# EAGLE design final routing_ratsnest (EAGLE 7.6.0)
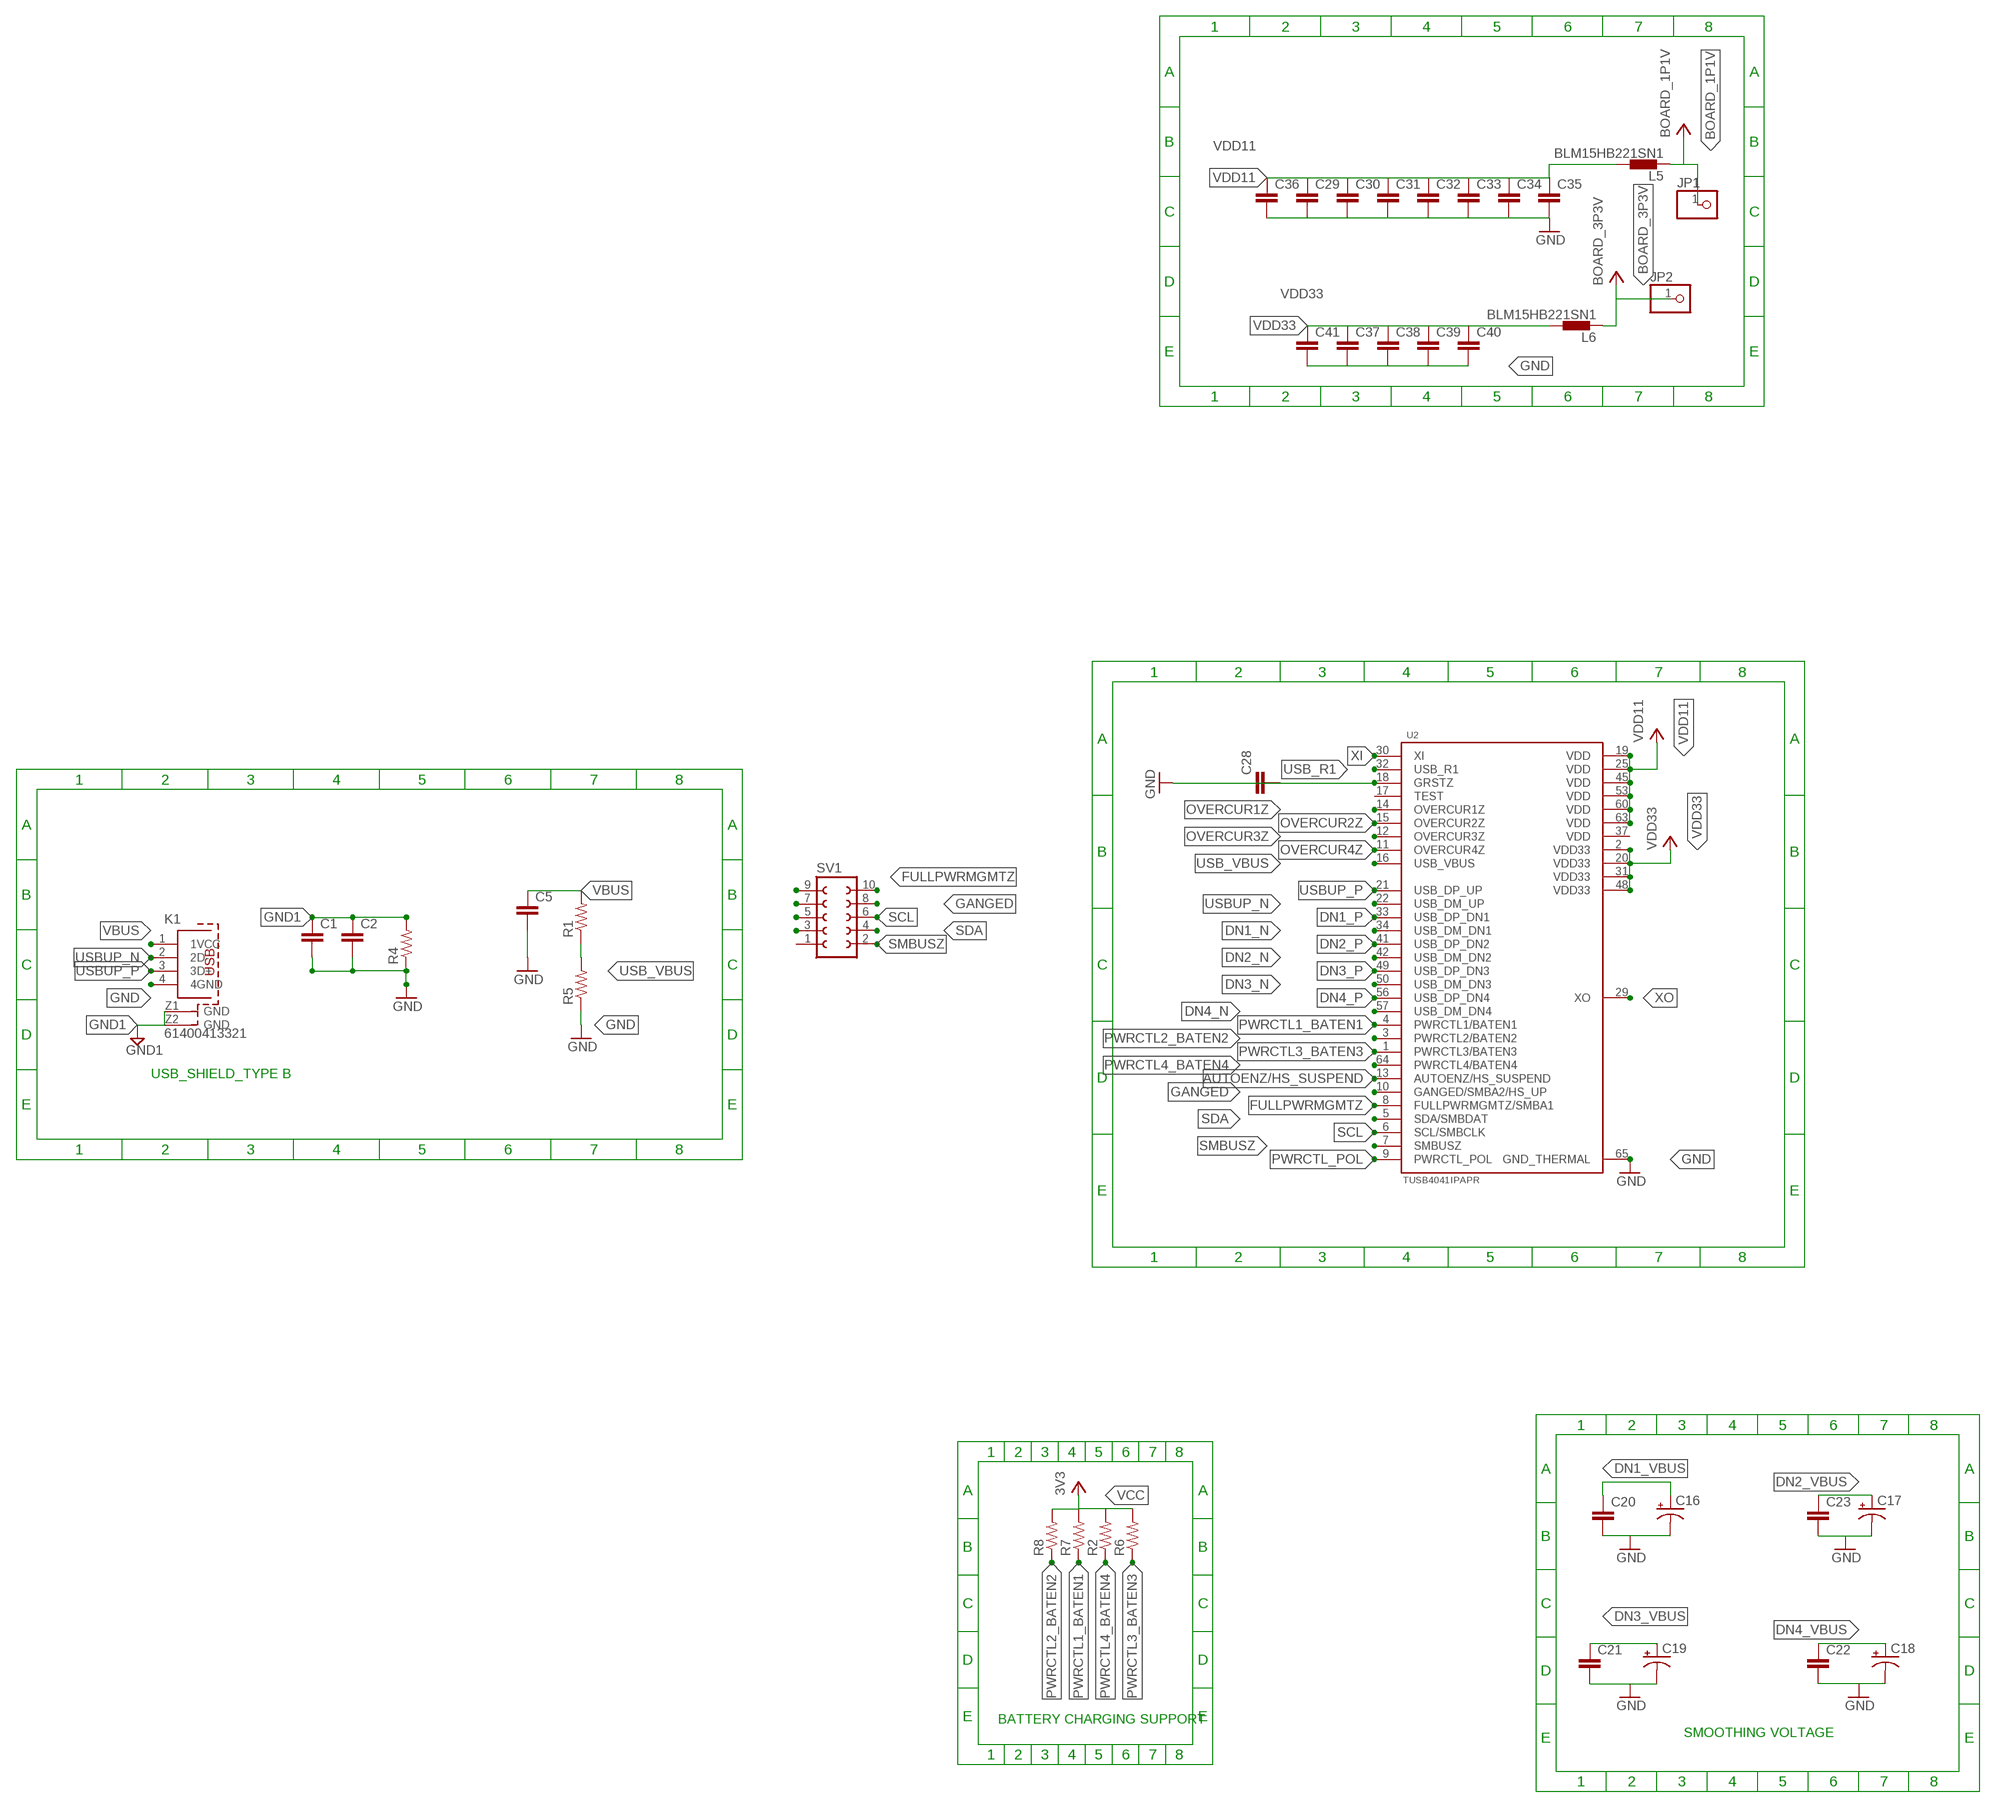
[diagram p0: schematic, sheet 1, part 1 of 2]
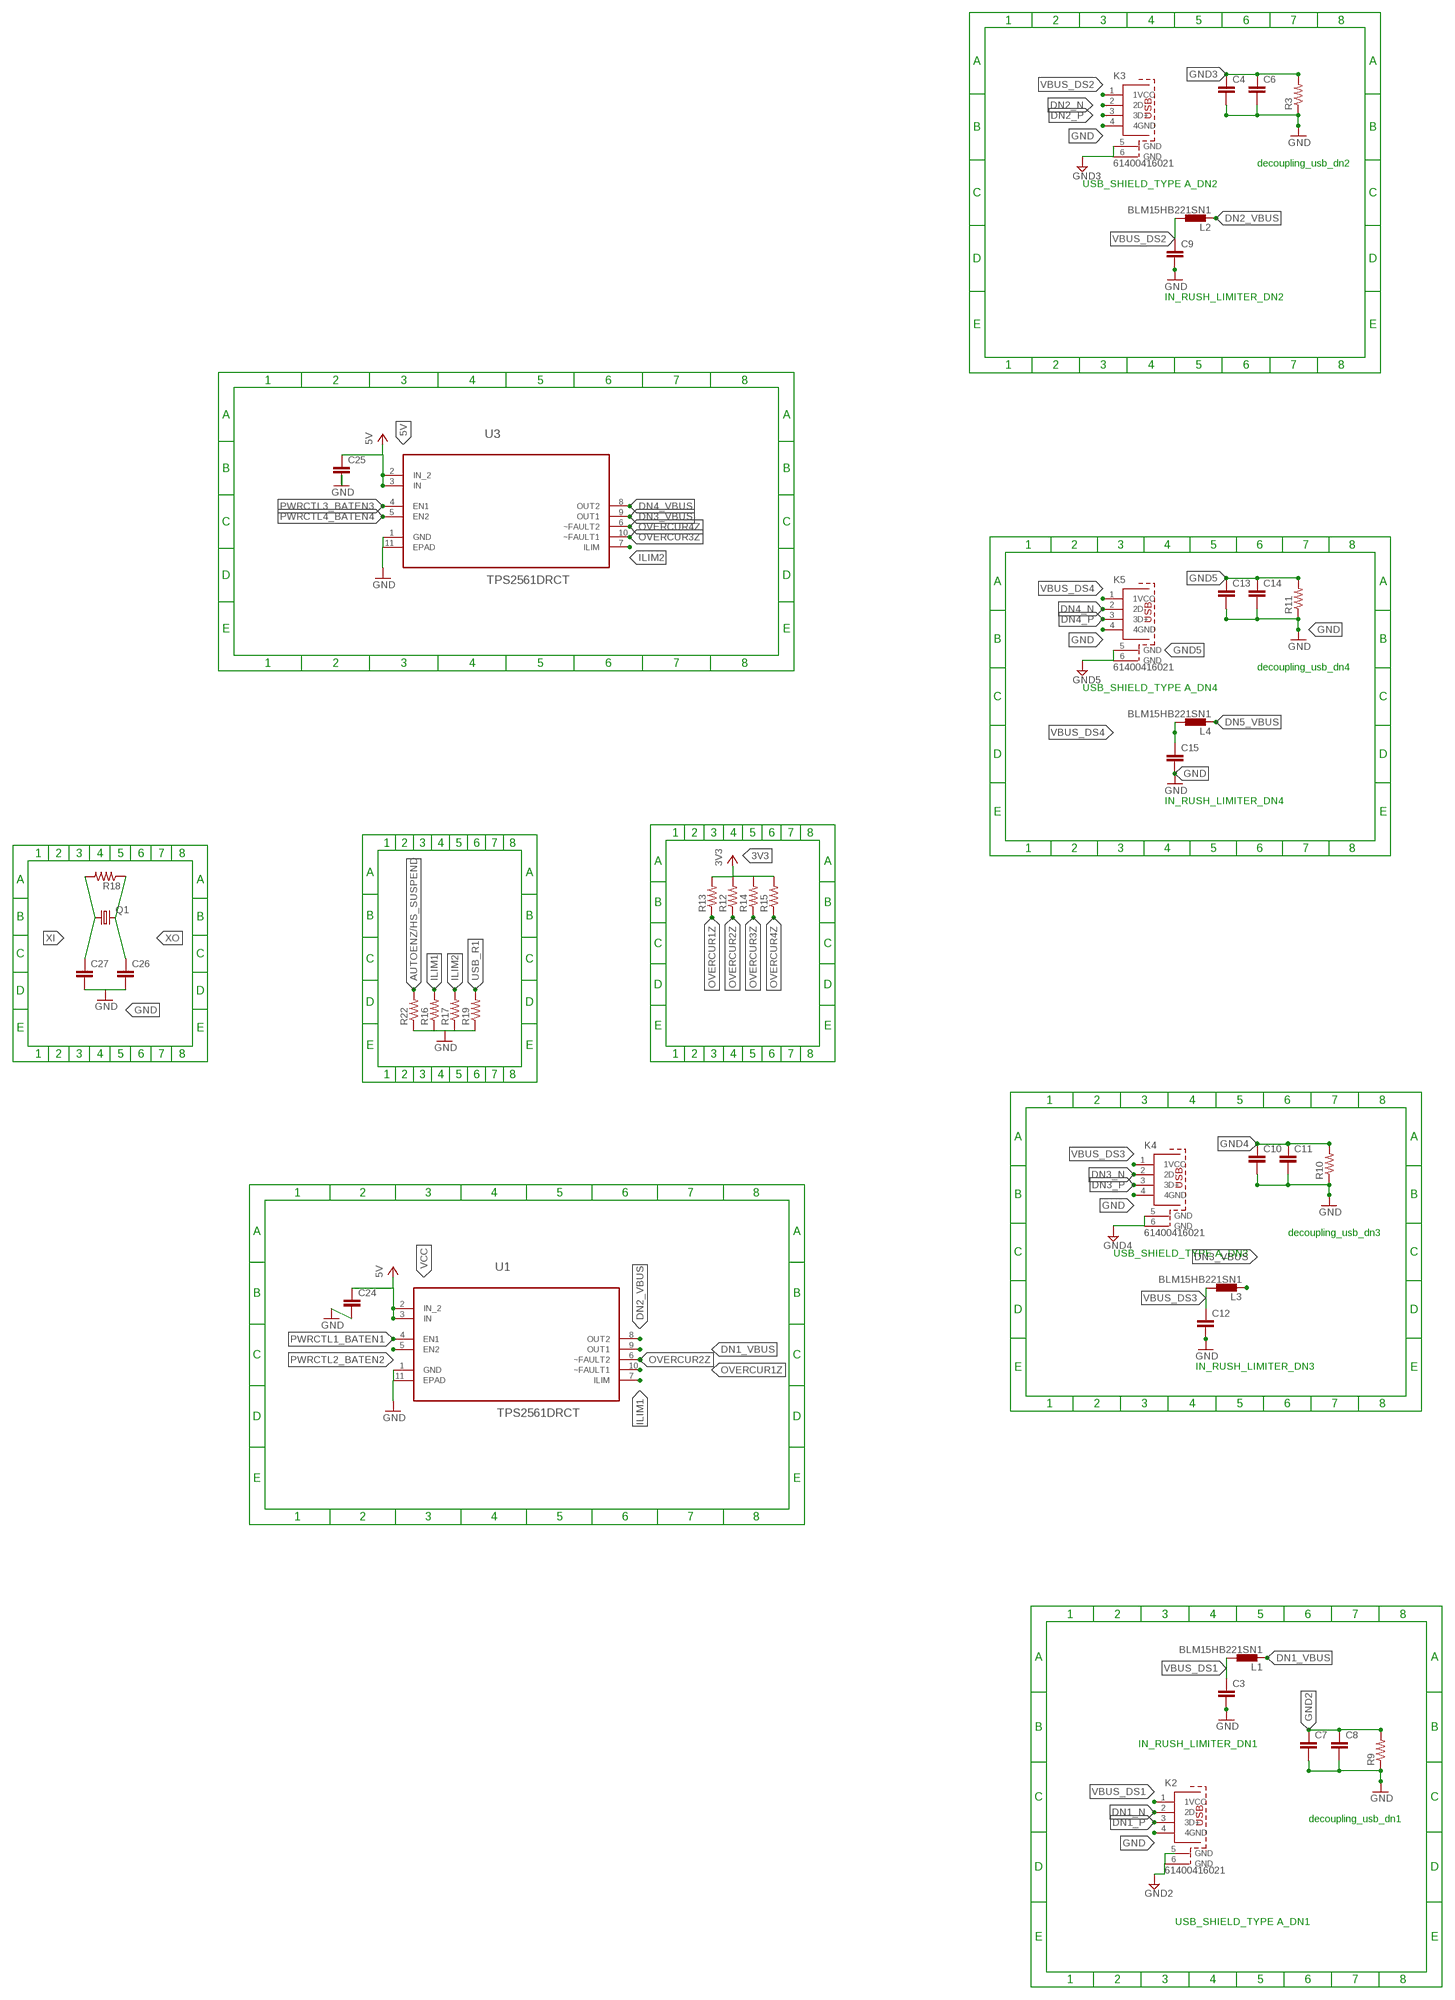
[diagram p1: schematic, sheet 1, part 2 of 2]

## Parts
C1  C2.5/4  [C2.5-4]
C2  C2.5/4  [C2.5-4]
C3  C2.5/4  [C2.5-4]
C4  C2.5/4  [C2.5-4]
C5  C2.5/4  [C2.5-4]
C6  C2.5/4  [C2.5-4]
C7  C2.5/4  [C2.5-4]
C8  C2.5/4  [C2.5-4]
C9  C2.5/4  [C2.5-4]
C10  C2.5/4  [C2.5-4]
C11  C2.5/4  [C2.5-4]
C12  C2.5/4  [C2.5-4]
C13  C2.5/4  [C2.5-4]
C14  C2.5/4  [C2.5-4]
C15  C2.5/4  [C2.5-4]
C16  CPOL-USE5-5  [E5-5]
C17  CPOL-USE5-5  [E5-5]
C18  CPOL-USE5-5  [E5-5]
C19  CPOL-USE5-5  [E5-5]
C20  C2.5/2  [C2.5-2]
C21  C2.5/2  [C2.5-2]
C22  C2.5/2  [C2.5-2]
C23  C2.5/2  [C2.5-2]
C24  C2.5/2  [C2.5-2]
C25  C2.5/2  [C2.5-2]
C26  C2.5/2  [C2.5-2]
C27  C2.5/2  [C2.5-2]
C28  C2.5/2  [C2.5-2]
C29  C2.5/2  [C2.5-2]
C30  C2.5/2  [C2.5-2]
C31  C2.5/2  [C2.5-2]
C32  C2.5/2  [C2.5-2]
C33  C2.5/2  [C2.5-2]
C34  C2.5/2  [C2.5-2]
C35  C2.5/2  [C2.5-2]
C36  C2.5/2  [C2.5-2]
C37  C2.5/2  [C2.5-2]
C38  C2.5/2  [C2.5-2]
C39  C2.5/2  [C2.5-2]
C40  C2.5/2  [C2.5-2]
C41  C2.5/2  [C2.5-2]
JP1  PINHD-1X1  [1X01]
JP2  PINHD-1X1  [1X01]
K1  61400413321  [61400413321]
K2  61400416021  [61400416021]
K3  61400416021  [61400416021]
K4  61400416021  [61400416021]
K5  61400416021  [61400416021]
L1  BLM15HB221SN1  [0402]
L2  BLM15HB221SN1  [0402]
L3  BLM15HB221SN1  [0402]
L4  BLM15HB221SN1  [0402]
L5  BLM15HB221SN1  [0402]
L6  BLM15HB221SN1  [0402]
Q1  CRYSTALHC49S  [HC49/S]
R1  R-US_R2010W  [R2010W]
R2  R-US_R2010W  [R2010W]
R3  R-US_R2010W  [R2010W]
R4  R-US_R2010W  [R2010W]
R5  R-US_R2010W  [R2010W]
R6  R-US_R2010W  [R2010W]
R7  R-US_R2010W  [R2010W]
R8  R-US_R2010W  [R2010W]
R9  R-US_R2010W  [R2010W]
R10  R-US_R2010W  [R2010W]
R11  R-US_R2010W  [R2010W]
R12  R-US_R2010W  [R2010W]
R13  R-US_R2010W  [R2010W]
R14  R-US_R2010W  [R2010W]
R15  R-US_R2010W  [R2010W]
R16  R-US_R2010W  [R2010W]
R17  R-US_R2010W  [R2010W]
R18  R-US_R2010W  [R2010W]
R19  R-US_R2010W  [R2010W]
R22  R-US_R2010W  [R2010W]
SV1  FE05-2  [FE05-2]
U1  TPS2561DRCT  [SON50P300X300X100-11N]
U2  TUSB4041IPAPR  [QFP50P1200X1200X105-65N]
U3  TPS2561DRCT  [SON50P300X300X100-11N]

## Nets
3V3: R12.2 R13.2 R14.2 R15.2
5V: C25.1 U3.2(IN_2) U3.3(IN)
AUTOENZ/HS_SUSPEND: R22.2 U2.13(AUTOENZ/HS_SUSPEND)
BOARD_1P1V: JP1.1 L5.1
BOARD_3P3V: JP2.1 L6.1
DN1_N: K2.2(2D-) U2.34(USB_DM_DN1)
DN1_P: K2.3(3D+) U2.33(USB_DP_DN1)
DN1_VBUS: C16.+ C20.1 L1.1 U1.9(OUT1)
DN2_N: K3.2(2D-) U2.42(USB_DM_DN2)
DN2_P: K3.3(3D+) U2.41(USB_DP_DN2)
DN2_VBUS: C17.+ C23.1 L2.1 U1.8(OUT2)
DN3_N: K4.2(2D-) U2.50(USB_DM_DN3)
DN3_P: K4.3(3D+) U2.49(USB_DP_DN3)
DN3_VBUS: C19.+ C21.1 L3.1 U3.9(OUT1)
DN4_N: K5.2(2D-) U2.57(USB_DM_DN4)
DN4_P: K5.3(3D+) U2.56(USB_DP_DN4)
DN4_VBUS: C18.+ C22.1 U3.8(OUT2)
DN5_VBUS: L4.1
FULLPWRMGMTZ: SV1.10 U2.8(FULLPWRMGMTZ/SMBA1)
GANGED: SV1.8 U2.10(GANGED/SMBA2/HS_UP)
GND: C1.2 C2.2 C3.2 C4.2 C5.2 C6.2 C7.2 C8.2 C9.2 C10.2 C11.2 C12.2 C13.2 C14.2 C15.2 C16.- C17.- C18.- C19.- C20.2 C21.2 C22.2 C23.2 C24.2 C25.2 C26.2 C27.2 C28.2 C29.2 C30.2 C31.2 C32.2 C33.2 C34.2 C35.2 C36.2 C37.2 C38.2 C39.2 C40.2 C41.2 K1.4(4GND) K2.4(4GND) K3.4(4GND) K4.4(4GND) K5.4(4GND) R3.1 R4.1 R5.1 R9.1 R10.1 R11.1 R16.1 R17.1 R19.1 R22.1 U1.1(GND) U1.11(EPAD) U2.65(GND_THERMAL) U3.1(GND) U3.11(EPAD)
GND1: C1.1 C2.1 K1.Z1(GND) K1.Z2(GND) R4.2
GND2: C7.1 C8.1 K2.5(GND) K2.6(GND) R9.2
GND3: C4.1 C6.1 K3.5(GND) K3.6(GND) R3.2
GND4: C10.1 C11.1 K4.5(GND) K4.6(GND) R10.2
GND5: C13.1 C14.1 K5.5(GND) K5.6(GND) R11.2
GRSTZ: C28.1 U2.18(GRSTZ)
ILIM1: R16.2 U1.7(ILIM)
ILIM2: R17.2 U3.7(ILIM)
N$2: SV1.3
N$3: SV1.5
N$4: SV1.7
N$5: SV1.9
OVERCUR1Z: R13.1 U1.10(~FAULT1) U2.14(OVERCUR1Z)
OVERCUR2Z: R12.1 U1.6(~FAULT2) U2.15(OVERCUR2Z)
OVERCUR3Z: R14.1 U2.12(OVERCUR3Z) U3.10(~FAULT1)
OVERCUR4Z: R15.1 U2.11(OVERCUR4Z) U3.6(~FAULT2)
PWRCTL1_BATEN1: R7.1 U1.4(EN1) U2.4(PWRCTL1/BATEN1)
PWRCTL2_BATEN2: R8.1 U1.5(EN2) U2.3(PWRCTL2/BATEN2)
PWRCTL3_BATEN3: R6.1 U2.1(PWRCTL3/BATEN3) U3.4(EN1)
PWRCTL4_BATEN4: R2.1 U2.64(PWRCTL4/BATEN4) U3.5(EN2)
PWRCTL_POL: U2.9(PWRCTL_POL)
SCL: SV1.6 U2.6(SCL/SMBCLK)
SDA: SV1.4 U2.5(SDA/SMBDAT)
SMBUSZ: SV1.2 U2.7(SMBUSZ)
USB_R1: R19.2 U2.32(USB_R1)
USB_VBUS: R1.1 R5.2 U2.16(USB_VBUS)
USBUP_N: K1.2(2D-) U2.22(USB_DM_UP)
USBUP_P: K1.3(3D+) U2.21(USB_DP_UP)
VBUS: C5.1 K1.1(1VCC) R1.2
VBUS_DS1: C3.1 K2.1(1VCC) L1.2
VBUS_DS2: C9.1 K3.1(1VCC) L2.2
VBUS_DS3: C12.1 K4.1(1VCC) L3.2
VBUS_DS4: C15.1 K5.1(1VCC) L4.2
VCC: C24.1 R2.2 R6.2 R7.2 R8.2 U1.2(IN_2) U1.3(IN) ; supply symbol labelled 3V3, 5V
VDD11: C29.1 C30.1 C31.1 C32.1 C33.1 C34.1 C35.1 C36.1 L5.2 U2.19(VDD) U2.25(VDD) U2.45(VDD) U2.53(VDD) U2.60(VDD) U2.63(VDD)
VDD33: C37.1 C38.1 C39.1 C40.1 C41.1 L6.2 U2.2(VDD33) U2.20(VDD33) U2.31(VDD33) U2.48(VDD33)
XI: C27.1 Q1.1 R18.2 U2.30(XI)
XO: C26.1 Q1.2 R18.1 U2.29(XO)
Unconnected: SV1.1 U2.17(TEST)

## Notes on the sheet
- decoupling_usb_dn2
- USB_SHIELD_TYPE A_DN2
- IN_RUSH_LIMITER_DN2
- decoupling_usb_dn4
- USB_SHIELD_TYPE A_DN4
- IN_RUSH_LIMITER_DN4
- USB_SHIELD_TYPE B
- decoupling_usb_dn3
- USB_SHIELD_TYPE A_DN3
- IN_RUSH_LIMITER_DN3
- BATTERY CHARGING SUPPORT
- SMOOTHING VOLTAGE
- IN_RUSH_LIMITER_DN1
- decoupling_usb_dn1
- USB_SHIELD_TYPE A_DN1

## Power pins joined to a net without a drawn wire
VDD: U2.37(VDD)

## Library data of the parts
C1-C15 C20-C41 = capacitor-wima:C: CAPACITOR naming: grid - package width
C16-C19 = rcl:CPOL-US: POLARIZED CAPACITOR, American symbol
JP1 JP2 = pinhead:PINHD-1X1: PIN HEADER
K1 = Wurth_Input-Output_Connectors_rev15d:61400413321: WR-COM Vertical USB Type B,4 pins=>Code : Con_I-O_COM_USB-2.0_B_61400413321 <http://katalog.we-online.de/media/images/eican/Con_I-O_COM_USB-2.0_B_61400413321_pf2.jpg> Details see: http://katalog.we-online.de/en/em/614_0xx_133_21 Created 2014-07-09, Karrer Zheng 2014 (C) Würth Elektronik
K2-K5 = Wurth_Input-Output_Connectors_rev15d:61400416021: WR-COM Horizontal USB Type A=>Code :Con_I-O_COM_USB_2.0_A_61400416021 <http://katalog.we-online.de/media/images/eican/Con_I-O_COM_USB_2.0_A_61400416021_pf2.jpg> Details see: http://katalog.we-online.de/en/em/614_004_160_21 Created 2014-07-09, Karrer Zheng 2014 (C) Würth Elektronik
L1-L6 = inductors:BLM15H: EMIFIL (R) Chip Ferrite Bead for GHz Noise Source: http://www.murata.com/ Ferrite Bead BLM15H.pdf
Q1 = crystal:CRYSTAL: CRYSTAL; OC_FARNELL: 1667008; OC_NEWARK: unknown
R1-R19 R22 = resistor:R-US_: RESISTOR, American symbol
SV1 = con-lsta:FE05-2: FEMALE HEADER; OC_FARNELL: unknown; OC_NEWARK: unknown
U1 U3 = TPS2561DRCT:TPS2561DRCT: DUAL CHANNEL PRECISION ADJUSTABLE CURRENT-LIMITED POWER SWITCHES; AVAILABILITY: Good; DESCRIPTION: Dual Channel Precision Adjustable Current-Limited Power Switches 10-VSON -40 to 85; MF: Texas Instruments; MP: TPS2561DRCT; PACKAGE: VSON-10 Texas Instruments; PRICE: 1.89 USD
U2 = TUSB4041IPAPR:TUSB4041IPAPR: Four-Port USB 2.0 Hub 64-HTQFP -40 to 85; AVAILABILITY: Warning; DESCRIPTION: Four-Port USB 2.0 Hub 64-HTQFP -40 to 85; MF: Texas Instruments; MP: TUSB4041IPAPR; PACKAGE: HTQFP-64 Texas Instruments; PRICE: 4.30 USD

## Net classes
0 DN4: width 0.254 mm, drill 0.381 mm, clearance 0.254 mm
1 DN3: width 0.254 mm, drill 0.381 mm, clearance 0.254 mm
2 DN2: width 0.254 mm, drill 0.381 mm, clearance 0.254 mm
3 DN1: width 0.254 mm, drill 0.381 mm, clearance 0.254 mm

## Board
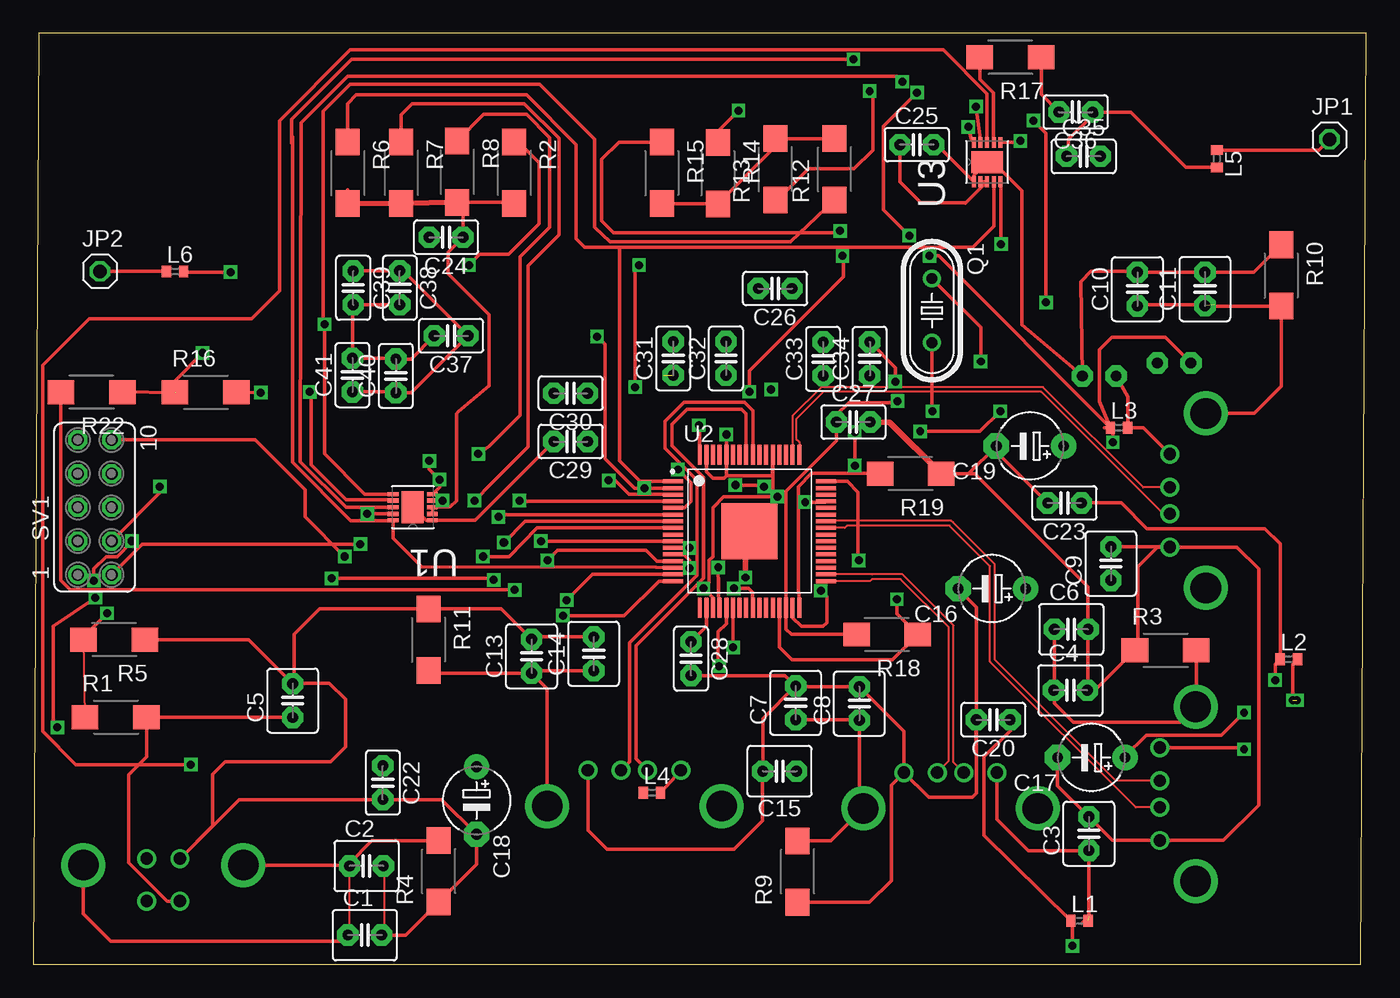
[diagram p2: board, top side]
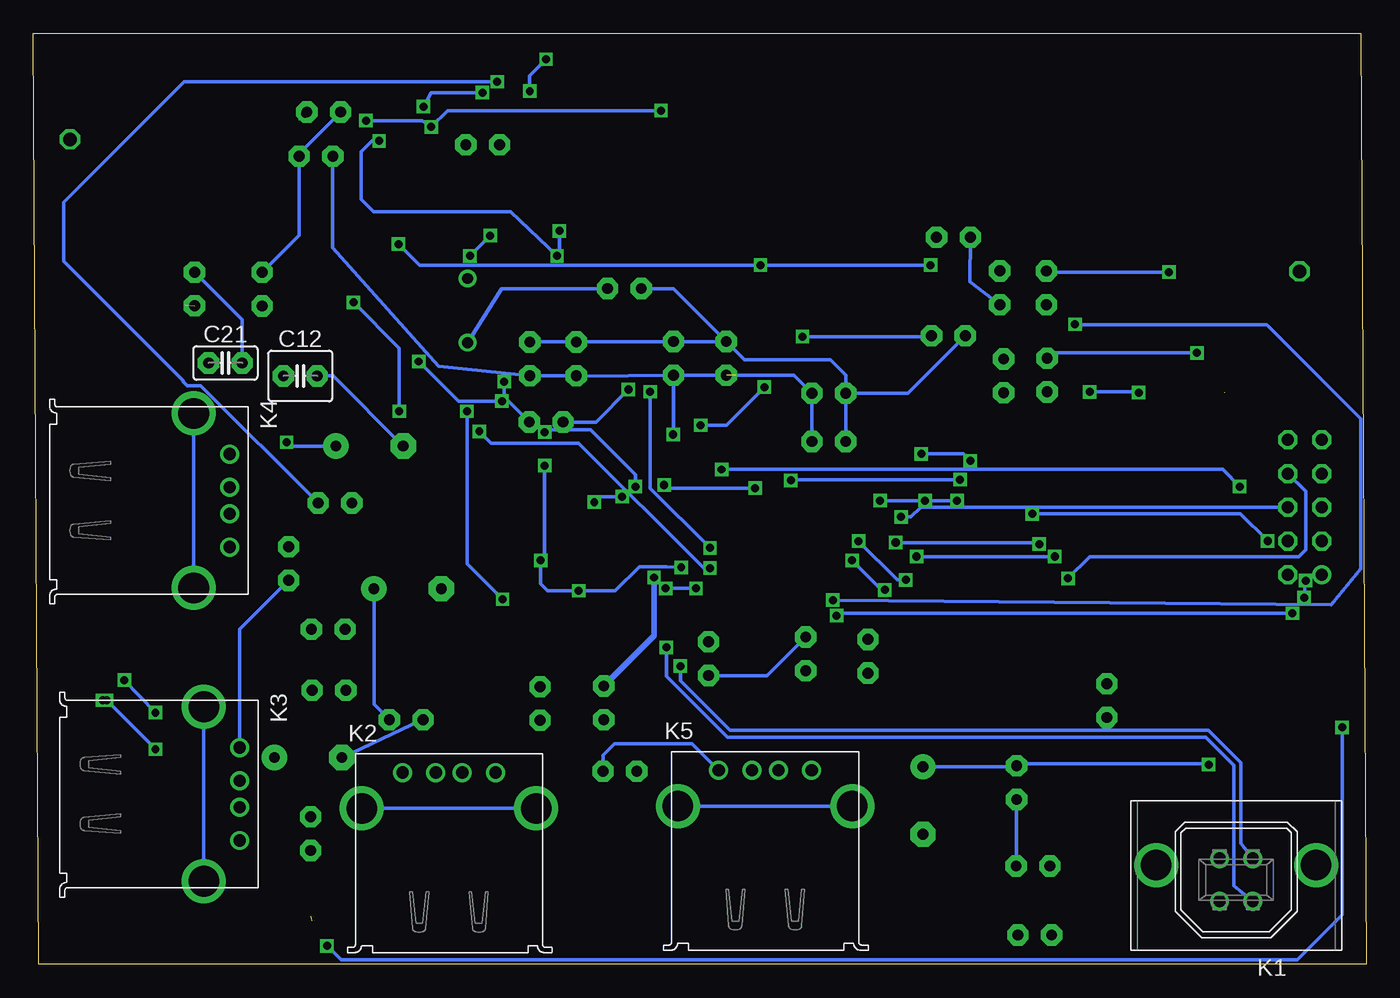
[diagram p3: board, bottom side, seen from below]

Size 100.41 x 70.11 mm. Coordinates in mm from the lower left corner, seen from the top.
Outline: 0,0 100,0 100.41,70.11 0.41,70.11 0,0
Copper layers (1*16): Top 0.035mm / dielectric 1.5mm / Bottom 0.035mm
Design rules "default *": minimum track width 6mil, minimum drill 24mil, track to track 8mil, track to pad 8mil, pad to pad 8mil, via to via 8mil, smd to smd 8mil, copper to edge 40mil, drill to drill 8mil, minimum pad ring 10mil, minimum via ring 8mil, stop-mask expansion 4mil, vias tented up to drill 0mil, thermal gap 10mil

### Footprints (pad centres in the part's own frame; a part is rotated, then mirrored left to right if it is on the bottom)
C2.5-4 = drill 0.813 pad 1.6 octagon: 1 -1.27,0; 2 1.27,0
E5-5 = drill 0.813 pad 1.905: + -2.54,0 | drill 0.813 pad 1.905 octagon: - 2.54,0
C2.5-2 = drill 0.813 pad 1.6 octagon: 1 -1.27,0; 2 1.27,0
1X01 = drill 1.016 octagon: 1 0,0
61400413321 = drill 0.92: 1 1.25,0; 2 -1.25,0; 3 -1.25,-3.2; 4 1.25,-3.2 | drill 2.3: Z1 -6.02,-2.7; Z2 6.02,-2.7
61400416021 = drill 0.92: 1 -3.5,2.7; 2 -1,2.7; 3 1,2.7; 4 3.5,2.7 | drill 2.3: 5 -6.57,0; 6 6.57,0
0402 = smd 0.7 x 0.9: 1 -0.65,0; 2 0.65,0
HC49/S = drill 0.813: 1 -2.413,0; 2 2.413,0
R2010W = smd 2 x 1.8: 1 -2.311,0; 2 2.311,0
FE05-2 = drill 0.914: 1 -5.08,1.27 | drill 0.914 octagon: 2 -5.08,-1.27; 3 -2.54,1.27; 4 -2.54,-1.27; 5 0,1.27; 6 0,-1.27; 7 2.54,1.27; 8 2.54,-1.27; 9 5.08,1.27; 10 5.08,-1.27
SON50P300X300X100-11N = smd 0.813 x 0.305: 1 -1.473,0.991; 2 -1.473,0.508; 3 -1.473,0; 4 -1.473,-0.508; 5 -1.473,-0.991; 6 1.473,-0.991; 7 1.473,-0.508; 8 1.473,0; 9 1.473,0.508; 10 1.473,0.991 | smd 1.651 x 2.388: 11 0,0
QFP50P1200X1200X105-65N = smd 1.5 x 0.3: 1 -5.75,3.75; 2 -5.75,3.25; 3 -5.75,2.75; 4 -5.75,2.25; 5 -5.75,1.75; 6 -5.75,1.25; 7 -5.75,0.75; 8 -5.75,0.25; 9 -5.75,-0.25; 10 -5.75,-0.75; 11 -5.75,-1.25; 12 -5.75,-1.75; 13 -5.75,-2.25; 14 -5.75,-2.75; 15 -5.75,-3.25; 16 -5.75,-3.75; 33 5.75,-3.75; 34 5.75,-3.25; 35 5.75,-2.75; 36 5.75,-2.25; 37 5.75,-1.75; 38 5.75,-1.25; 39 5.75,-0.75; 40 5.75,-0.25; 41 5.75,0.25; 42 5.75,0.75; 43 5.75,1.25; 44 5.75,1.75; 45 5.75,2.25; 46 5.75,2.75; 47 5.75,3.25; 48 5.75,3.75 | smd 0.3 x 1.5: 17 -3.75,-5.75; 18 -3.25,-5.75; 19 -2.75,-5.75; 20 -2.25,-5.75; 21 -1.75,-5.75; 22 -1.25,-5.75; 23 -0.75,-5.75; 24 -0.25,-5.75; 25 0.25,-5.75; 26 0.75,-5.75; 27 1.25,-5.75; 28 1.75,-5.75; 29 2.25,-5.75; 30 2.75,-5.75; 31 3.25,-5.75; 32 3.75,-5.75; 49 3.75,5.75; 50 3.25,5.75; 51 2.75,5.75; 52 2.25,5.75; 53 1.75,5.75; 54 1.25,5.75; 55 0.75,5.75; 56 0.25,5.75; 57 -0.25,5.75; 58 -0.75,5.75; 59 -1.25,5.75; 60 -1.75,5.75; 61 -2.25,5.75; 62 -2.75,5.75; 63 -3.25,5.75; 64 -3.75,5.75 | smd 4.2 x 4.2: 65 0,0

### Placement (x,y rotation side)
C1  24.98,2.21 0 top
C2  25.1,7.42 0 top
C3  79.51,9.84 90 top
C4  78.12,20.64 0 top
C5  19.55,19.87 90 top
C6  78.18,25.23 0 top
C7  57.43,19.69 90 top
C8  62.22,19.64 90 top
C9  81.18,30.18 90 top
C10  83.17,50.84 90 top
C11  88.26,50.85 90 top
C12  80.29,44.3 0 bottom
C13  37.54,23.2 90 top
C14  42.22,23.39 90 top
C15  56.22,14.55 180 top
C16  72.21,28.29 180 top
C17  79.7,15.57 180 top
C18  33.39,12.34 270 top
C19  75.08,39.03 180 top
C20  72.32,18.42 180 top
C21  85.93,45.29 0 bottom
C22  26.33,13.68 270 top
C23  77.67,34.74 180 top
C24  31.1,54.75 180 top
C25  66.55,61.72 0 top
C26  55.88,50.89 180 top
C27  61.77,40.84 0 top
C28  49.55,23.02 270 top
C29  40.48,39.37 180 top
C30  40.48,43 180 top
C31  48.21,45.63 90 top
C32  52.18,45.63 90 top
C33  59.5,45.59 90 top
C34  63.01,45.6 90 top
C35  79.11,60.84 0 top
C36  78.52,64.18 180 top
C37  31.48,47.33 180 top
C38  27.61,50.95 270 top
C39  24.1,50.94 270 top
C40  27.32,44.31 90 top
C41  24.05,44.38 90 top
JP1  97.64,62.13 0 top
JP2  5.03,52.18 0 top
K1  9.8,4.77 180 bottom
K2  69.09,11.74 0 bottom
K3  87.56,12.83 270 bottom
K4  88.32,34.92 270 bottom
K5  45.28,11.92 0 bottom
L1  78.81,3.27 0 top
L2  94.57,22.99 0 top
L3  81.79,40.42 0 top
L4  46.6,12.93 0 top
L5  89.14,60.66 270 top
L6  10.68,52.17 0 top
Q1  67.69,49.23 270 top
R1  6.22,18.62 0 top
R2  36.23,59.6 270 top
R3  85.29,23.65 0 top
R4  30.54,7.01 90 top
R5  6.11,24.46 180 top
R6  23.69,59.6 270 top
R7  27.72,59.61 270 top
R8  31.93,59.68 270 top
R9  57.57,6.99 90 top
R10  94,51.88 270 top
R11  29.77,24.45 270 top
R12  60.37,59.86 90 top
R13  55.89,59.86 90 top
R14  51.56,59.58 270 top
R15  47.35,59.6 270 top
R16  12.99,43.08 0 top
R17  73.61,68.3 180 top
R18  64.32,24.84 180 top
R19  66.09,36.95 180 top
R22  4.4,43.09 180 top
SV1  4.63,34.42 90 top
U1  28.59,34.42 180 top
U2  53.95,32.62 0 top
U3  71.85,60.41 90 top

### Tracks (layer width: path | path; a pad name or v marks a point on that pad's centre or on a via)
3V3
  Top 0.254: R12.2 R13.2 55.89,61.6 R14.2 47.37,57.27 R15.2
5V
  Top 0.254: 70.21,57.3 70.24,57.33 | 70.24,57.33 U3.3 U3.2 | C25.1 65.28,58.92 66.86,57.33 70.24,57.33
AUTOENZ/HS_SUSPEND  (via drill 0.61)
  Top 0.254: U2.13 46.97,30.37 46.16,31.18 39.49,31.18 v38.73,30.42 | v36.27,28.2 5.38,28.2 4.5,28.2 2.81,28.2 2.09,28.91 R22.2
  Bottom 0.254: v38.73,30.42 36.5,28.2 v36.27,28.2
BOARD_1P1V
  Top 0.254: L5.1 96.82,61.31 JP1.1
BOARD_3P3V
  Top 0.254: JP2.1 10.02,52.18 L6.1
DN1_N
  Top 0.152: K2.2 69.33,15.21 69.33,25.52 65.48,29.37 63.18,29.37 U2.34
DN1_P
  Top 0.152: K2.3 68.97,15.32 68.97,25.37 65.33,29.01 63.18,29.01 63.03,28.87 U2.33
DN1_VBUS  (via drill 0.61)
  Top 0.254: C20.1 73.59,17.61 71.6,15.62 71.6,9.71 L1.1 78.27,3.16 v78.27,1.4 | U1.9 27.1,33.93 v25.16,33.93 | v7.43,31.88 7.43,31.82 6.32,30.71 5.5,30.71 4.56,29.78 v4.56,28.9 | v4.68,27.61 4.62,27.55 1.52,25.45 1.52,18.14 v1.81,17.84
  Bottom 0.254: C20.1 74.75,19.58 C16.+ | v25.16,33.93 9.48,33.93 v7.43,31.88 | v4.56,28.9 4.62,28.43 v4.68,27.61 | v1.81,17.84 1.81,3.74 5.21,0.35 77.22,0.35 v78.27,1.4
DN2_N
  Top 0.152: K3.2 81.54,13.83 72.42,22.95 72.42,30.14 69.27,33.3 69.25,33.3 69.15,33.4 59.74,33.4
  Top 0.254: 59.74,33.4 U2.42
DN2_P
  Top 0.152: K3.3 83.04,11.83 72.07,22.8 72.07,30 69.02,33.04 61.71,33.04 61.3,33.04 61.13,32.88 59.72,32.88
  Top 0.254: 59.72,32.88 U2.41
DN2_VBUS  (via drill 0.6)
  Top 0.254: C23.1 81.97,34.74 83.89,32.82 92.78,32.82 93.92,31.68 L2.1 93.54,22.61 v93.54,21.41 | C17.+ 82.24,15.66 83.83,17.26 89.5,17.26 v91.2,18.95 | U1.8 23.55,34.42 20.12,37.85 20.18,62.59 20.18,63.35 23.69,66.86 65.05,66.86 v65.46,66.46
  Bottom 0.254: v91.2,18.95 v93.54,21.41 | C23.1 87.78,43.58 88.8,43.58 89.1,43.88 89.1,43.93 98.11,52.94 98.11,57.39 89.04,66.46 66.28,66.46 v65.46,66.46
DN3_N
  Top 0.152: K4.2 83.61,35.92 76.06,43.47 59.36,43.47 57.2,41.31 U2.50 | U2.50
DN3_P
  Top 0.152: K4.3 85.11,33.92 75.92,43.11 59.51,43.11 57.46,41.06 57.46,39.6 57.7,39.35 U2.49
DN3_VBUS  (via drill 0.6, 0.61)
  Top 0.254: L3.1 80.67,40.42 | v66.57,65.64 64.06,63.12 64.06,56.8 v65.99,54.87 | v71.02,64.58 71.37,61.91 U3.9 | v67.51,53.35 68.21,53.35 L3.1 | v81.31,39.31 81.31,40.24 L3.1 | C21.1 85.28,47.21 81.26,47.21 80.32,46.27 80.32,42.41 L3.1
  Bottom 0.254: v66.57,65.64 70.43,65.64 v71.02,64.58 | v65.99,54.87 v67.51,53.35 | C19.+ 81.03,39.03 v81.31,39.31
DN4_N
  Top 0.254: K5.2 45.42,15.48 45.42,24 50.51,29.09 50.51,36.67 48.11,39.07 48.11,40.67 49.24,41.81 53.36,41.81 53.7,41.47 U2.57
DN4_P
  Top 0.254: K5.3 44.91,15.25 44.91,24.21 50,29.3 50,36.46 47.6,38.86 47.6,40.88 49.03,42.32 53.57,42.32 54.2,41.69 U2.56
DN4_VBUS  (via drill 0.61)
  Top 0.254: v11.88,15.03 3.22,15.03 0.7,17.55 0.7,45.1 4.21,48.61 16.44,48.61 18.54,50.72 18.54,63.53 23.87,68.86 68.56,68.86 71.85,65.57 U3.8
  Bottom 0.254: C22.1 26.41,14.88 C18.+ 26.25,14.88 26.03,15.09 11.93,15.09 v11.88,15.03
FULLPWRMGMTZ  (via drill 0.61)
  Top 0.254: U2.8 37.96,32.87 35.86,30.71 v33.87,30.71 | v23.46,30.71 20.48,33.7 20.48,35.74 16.72,39.49 SV1.10
  Bottom 0.254: v33.87,30.71 v23.46,30.71
GANGED  (via drill 0.61)
  Top 0.254: U2.10 v38.24,31.87 | v22.46,29.07 34.57,29.07 v34.69,28.96
  Bottom 0.254: v22.46,29.07 20.83,30.71 5.09,30.71 4.56,31.24 4.56,35.62 SV1.8 | v34.69,28.96 35.33,28.96 v38.24,31.87
GND  (via drill 0.6, 0.61)  (1 unrouted)
  Top 0.152: C2.2 26.44,7.35 26.44,1.58
  Top 0.254: C1.2 28.06,2.21 R4.1 33.39,7.54 C18.- 30.77,12.41 C22.2 15.5,12.41 K1.4 13.51,10.43 13.51,14.33 14.45,15.27 22.41,15.27 23.52,16.38 23.52,19.95 22.29,21.18 19.59,21.18 C5.2 | 65.52,14.38 K2.4 | R3.1 79.96,20.64 C4.2 79.45,20.7 C6.2 79.44,25.25 79.44,28.43 70.93,36.95 R19.1 70.45,36.95 C19.- 72.54,38.61 C23.2 | C7.2 57.48,20.91 C8.2 65.59,17.55 K2.4 | 86.35,31.42 90.67,31.42 92.31,29.78 92.31,11.99 89.65,9.33 K3.4 81.3,9.33 C3.2 77.16,13.47 C17.- | 86.35,31.42 K4.4 84.66,31.42 83.19,29.95 83.19,23.17 | 88.25,52.11 C10.2 83.1,52.18 79.68,52.18 78.9,51.41 C12.2 74.47,48.15 74.47,58.27 72.33,60.41 U3.11 70.86,59.42 U3.1 68.07,61.72 C25.2 | 88.25,52.11 C11.2 | 88.25,52.11 91.93,52.11 R10.1 | C7.2 54.95,18.49 C15.2 54.93,14.53 54.93,10.82 52.77,8.66 43.23,8.66 41.78,10.11 K5.4 | C14.2 37.72,24.66 C13.2 35.24,26.77 R11.1 21.56,26.77 19.66,24.86 19.66,21.24 C5.2 | C38.2 27.6,49.67 C39.2 24.05,49.62 C41.2 27.25,45.65 C40.2 28.46,45.58 C37.2 | C16.- 71.05,26.91 C20.2 71.05,18.34 | K2.4 67.46,12.58 70.73,12.58 71.05,12.9 | R9.1 63,4.68 64.64,6.32 64.64,13.5 K2.4 | C9.2 86.31,31.45 86.35,31.42 | C29.2 33.27,33.43 U1.1 29.58,33.43 U1.11 | R22.1 6.74,43.11 10.71,43.06 | R17.1 75.92,65.51 C36.2 | R5.1 16.23,24.46 C5.2 | R16.1 10.68,43.96 v12.75,46.04 | 71.05,12.9 71.02,18.66 | v64.94,43.88 64.94,44.94 C34.2 | C28.2 56.64,21.75 C7.2 | 71.05,12.9 71.05,18.34 | 71.05,18.34 v71.14,18.43
  Top 0.406: C27.2 64.51,40.84 R19.1 | U2.65 53.65,32.31 v53.65,29.13
  Bottom 0.254: C33.2 | C33.2 C34.2 | C29.2 C30.2 | C33.2 52.21,46.87 C32.2 C31.2 | C31.2 46.82,45.51 40.37,45.51 39.21,44.36 C30.2 | C31.2 52.2,50.89 C26.2 | C36.2 80.56,60.87 C35.2 80.38,54.9 C10.2 | C28.2 45.12,21.75 C14.2 | C22.2 26.37,12.37 C2.2 | C21.2 84.66,48.53 C11.2 | v12.75,46.04 23.66,46.04 C41.2 | C37.2 34.54,43 C30.2 | C38.2 29.84,51.38 C24.2 | C19.- 77.81,44.3 C12.2 | C27.2 64.94,42.73 v64.94,43.88 | v71.14,18.43 C17.-
  Bottom 0.406: v53.65,29.13 53.65,24.75 C7.2
GND1
  Top 0.152: C1.1 23.83,2.34 C2.1
  Top 0.254: K1.Z1 3.78,3.82 5.85,1.75 23.25,1.75 C1.1 | K1.Z2 23.78,7.47 C2.1 23.83,7.63 25.51,9.3 30.53,9.3 R4.2
GND2
  Top 0.254: R9.2 60.08,9.3 K2.6 62.22,12.04 C8.1 62.17,18.42 C7.1
  Bottom 0.254: K2.6 K2.5
GND3
  Top 0.254: C6.1 76.92,20.7 | 76.92,20.7 C4.1 | R3.2 87.6,19.44 K3.5 86.41,18.25 78.33,18.25 76.92,19.67 76.92,20.7
  Bottom 0.254: K3.5 K3.6
GND4  (1 unrouted)
  Top 0.254: C10.1 83.26,49.67 88.98,49.67 89.08,49.56 R10.2 94.01,43.52 91.98,41.49 K4.5
  Bottom 0.254: K4.5 K4.6
GND5
  Top 0.254: R11.2 29.98,21.93 C13.1 | C13.1 37.72,22.12 C14.1 | C13.1 38.71,20.76 K5.6
  Bottom 0.254: K5.6 K5.5
GRSTZ
  Top 0.254: U2.18 50.7,25.45 C28.1
ILIM1  (via drill 0.61)
  Top 0.254: U1.7 27.07,34.98 23.58,34.98 20.94,37.62 20.94,43 v20.83,43.11 | v17.14,43.06 R16.2
  Bottom 0.254: v20.83,43.11 17.2,43.11 v17.14,43.06
ILIM2
  Top 0.254: R17.2 71.3,66.65 72.31,65.64 72.31,61.94 U3.7
OVERCUR1Z  (via drill 0.6)
  Top 0.254: 19.54,62.3 19.54,61.78 | 19.54,61.78 19.54,37.79 23.93,33.4 27.09,33.4 U1.10 27.12,32.08 29.25,29.95 46.92,29.89 U2.14 | R13.1 56.03,57.55 58.38,59.9 61.83,59.9 63.24,61.31 63.24,65.52 v63.01,65.75 | v61.78,68.15 23.98,68.15 19.48,63.65 19.48,61.83 19.54,61.78
  Bottom 0.254: v63.01,65.75 63.01,66.92 v61.78,68.15
OVERCUR2Z  (via drill 0.6)
  Top 0.254: U1.6 24.96,35.41 21.94,38.43 v21.94,48.2 21.82,48.32 21.82,64.23 23.87,66.28 38.14,66.28 42.3,62.13 42.3,55.52 43.47,54.41 57.04,54.41 R12.1 | U2.15 42.12,29.37 v40.19,27.44
  Bottom 0.254: v40.19,27.44 2.63,27.09 0.41,29.78 0.41,41.07 7.49,48.15 21.88,48.15 v21.94,48.2
OVERCUR3Z  (via drill 0.6)
  Top 0.254: U2.12 48.99,30.87 49.43,30.42 v49.43,29.84 | v66.81,40.13 71.31,40.13 v72.83,41.65 | v76.28,49.84 76.28,62.59 v75.35,63.53 | v70.43,63.06 70.67,62.08 U3.10 | R14.1 51.56,62.74 v53.12,64.29
  Bottom 0.254: v49.43,29.84 49.9,29.84 59.32,39.25 65.93,39.25 v66.81,40.13 | v72.83,41.65 72.83,46.39 v76.28,49.84 | v75.35,63.53 71.14,63.53 v70.43,63.06 69.21,64.29 v53.12,64.29
OVERCUR4Z  (via drill 0.6)
  Top 0.254: 47.56,62.36 R15.1 44.12,61.91 42.82,60.61 42.82,55.98 43.7,55.11 60.66,55.11 v60.78,55.22 | U2.11 v49.42,31.37 v49.43,31.36 | v53.94,43.11 53.94,44.69 61.02,51.77 61.02,53.12 v60.96,53.35 | v74.35,62.01 74.23,61.88 U3.6
  Bottom 0.254: v49.43,31.36 53.94,35.86 v53.94,43.11 | v74.35,62.01 74.88,62.01 75.7,61.19 75.7,57.62 74.76,56.69 64.47,56.69 v60.96,53.35 60.78,53.53 v60.78,55.22
PWRCTL1_BATEN1  (via drill 0.6)
  Top 0.254: v33.23,34.92 34.57,36.27 35.39,37.09 37.26,38.96 37.26,52.59 39.6,54.93 39.6,62.19 36.97,64.82 28.55,64.82 27.72,63.99 R7.1 | v30.83,34.92 U1.4 | U2.4 36.68,34.87 v36.62,34.92
  Bottom 0.254: v30.83,34.92 v33.23,34.92 v36.62,34.92
PWRCTL2_BATEN2  (via drill 0.6, 0.61)
  Top 0.254: 30.32,35.41 U1.5 30.6,35.94 v30.6,36.5 29.84,37.26 v29.84,37.91 | v43.35,36.45 43.82,36.45 44.87,35.39 48.18,35.39 U2.3 | v33.52,38.43 34.34,39.02 36.68,41.36 36.68,53.29 38.9,55.52 38.9,62.24 37.15,64 33.94,64 R8.1
  Bottom 0.254: v30.6,36.5 43.29,36.5 v43.35,36.45 | v33.52,38.43 30.36,38.43 v29.84,37.91
PWRCTL3_BATEN3
  Top 0.254: U3.4 72.36,55.58 70.78,53.99 44.75,53.99 44.17,53.99 | U2.1 45.71,36.37 44.17,37.91 44.17,53.99 | R6.1 23.69,64.81 24.34,65.46 37.15,65.46 40.89,61.72 40.89,54.64 41.53,53.99 44.17,53.99
PWRCTL4_BATEN4  (via drill 0.6, 0.61)
  Top 0.254: v72.89,54.23 72.89,58.89 U3.5 | U2.64 50.2,40.53 v50.13,40.6 | v45.34,43.47 45.34,52.36 v45.63,52.65 | R2.1 36.54,61.91 38.08,60.37 38.08,55.75 35.8,53.47 33.64,53.47 v32.82,52.65
  Bottom 0.254: v32.82,52.65 v45.63,52.65 71.31,52.65 v72.89,54.23 | v50.13,40.6 48.2,40.6 v45.34,43.47
SCL  (via drill 0.61)
  Top 0.254: U2.6 36.09,33.87 35.56,33.87 35.21,33.87 v35.04,33.7
  Bottom 0.254: SV1.6 33.56,34.42 34.28,33.7 v35.04,33.7
SDA  (via drill 0.6)
  Top 0.254: U2.5 49.05,34.37 49.55,34.87 49.55,36.27 v48.55,37.26 | v9.54,35.98 9.54,35.51 SV1.4
  Bottom 0.254: v48.55,37.26 10.82,37.26 v9.54,35.98
SMBUSZ  (via drill 0.61)
  Top 0.254: SV1.2 8.21,31.65 v24.63,31.65 | v35.45,31.77 37.05,33.37 U2.7
  Bottom 0.254: v24.63,31.65 24.75,31.77 v35.45,31.77
USB_R1
  Top 0.254: R19.2 63.76,36.97 58.62,36.97 57.62,35.98 57.62,27.96 57.68,27.9 57.68,26.89 U2.32
USB_VBUS  (via drill 0.6)
  Top 0.152: R1.1 3.91,18.72 R5.2
  Top 0.254: U2.16 47.12,28.87 44.52,26.27 40.31,26.27 v39.9,26.27 | R5.2 3.8,24.69 v5.56,26.44
  Bottom 0.254: v5.56,26.44 39.72,26.44 v39.9,26.27
USBUP_N  (via drill 0.61)
  Top 0.254: U2.22 v52.71,23.87
  Bottom 0.254: K1.2 9.96,5.93 9.96,14.99 12.1,17.12 48.13,17.12 52.71,21.7 v52.71,23.87
USBUP_P  (via drill 0.61)
  Top 0.254: U2.21 52.2,25.64 51.6,25.04 51.6,22.52 v51.66,22.46
  Bottom 0.254: K1.3 9.46,9.13 9.46,15.2 11.89,17.63 47.92,17.63 51.66,21.36 v51.66,22.46
VBUS
  Top 0.254: C5.1 12.72,18.62 R1.2 8.54,15.62 7.2,14.27 7.2,7.66 10.09,4.77 K1.1
VBUS_DS1  (1 unrouted)
  Top 0.254: 78.97,3.1 79.51,3.64 C3.1 74.96,8.57 72.6,10.94 K2.1
VBUS_DS2  (via drill 0.6)  (1 unrouted)
  Top 0.254: K3.1 91.08,16.33 v91.2,16.2 | v94.89,19.89 94.89,22.6 L2.2
  Bottom 0.254: v91.2,16.2 v94.89,19.89 | C9.1 84.86,25.23 K3.1
  other vias: 95.18,19.89
VBUS_DS3
  Top 0.254: C12.1 82.44,42.72 L3.2 83.62,40.42 K4.1
VBUS_DS4  (via drill 0.6)
  Top 0.254: L4.2 v48.83,14.67 K5.1
  Bottom 0.254: v48.83,14.67 50.77,16.61 56.63,16.61 57.51,15.74 57.51,15.68 57.49,15.66 C15.1
VCC
  Top 0.254: U1.2 U1.3 30.1,34.46 31.41,34.46 31.88,34.92 31.88,41.48 32,41.59 34.34,43.58 34.34,48.91 31.24,52.01 31.24,53.62 C24.1 32.37,56.94 R8.2 36.15,57.37 R2.2 | R6.2 23.69,58.32
  Top 0.406: R8.2 R7.2 R6.2
VDD11  (via drill 0.6, 0.61)  (1 unrouted)
  Top 0.254: L5.2 86.83,60.01 82.66,64.17 C36.1 | v79.92,64.05 78.02,62.15 C35.1 | v52.2,39.9 U2.60 52.2,36.8 | 52.2,36.8 55.69,36.8 U2.53 55.7,35.56 v56.04,35.22 52.01,35.22 51.19,34.4 51.19,30.71 50.9,30.42 50.9,28.72 v50.49,28.31 51.2,27.59 U2.19 | v58.15,34.81 59.65,34.81 U2.45 | v52.77,28.31 53.88,28.31 54.17,28.02 54.17,26.9 U2.25 | U2.63 50.7,37.1 51.19,36.62 52.03,36.62 52.2,36.8
  Bottom 0.254: C32.1 59.01,44.3 C33.1 C34.1 69.89,45.03 77.84,53.98 C35.1 | v79.92,64.05 C36.1 | 47.49,44.34 47.49,44.36 C32.1 | C29.1 C30.1 43.11,44.36 C31.1 | v56.04,35.22 57.74,35.22 v58.15,34.81 | v50.49,28.31 v52.77,28.31 | v52.2,39.9 52.18,39.92 C32.1
VDD33  (via drill 0.6, 0.61)
  Top 0.254: C41.1 27.25,43.11 C40.1 28.46,43.04 C37.1 27.86,52.22 C38.1 C39.1 | U2.31 57.2,26.1 57.86,25.45 59.49,25.45 59.79,25.74 59.79,27.67 v59.32,28.14 | v51.6,29.89 51.66,26.91 U2.20 | U2.2 45.27,35.87 43.06,38.08 43.06,46.68 v42.47,47.27 | U2.48 61.33,36.37 62.13,35.57 62.13,30.48 v62.19,30.42 | U2.2 46.28,35.87 46.27,35.86 | U2.2 v46.04,35.86 | v52.88,36.09 54.93,36.09 v55.05,35.98 | v61.89,40.07 v61.89,37.56 | v14.86,52.12 11.26,52.12 L6.2
  Bottom 0.254: v14.86,52.12 24.02,52.12 C39.1 | v51.6,29.89 52.71,29.95 54.76,29.95 56.57,28.14 v59.32,28.14 61.66,28.14 62.19,28.66 v62.19,30.42 61.89,30.71 v61.89,37.56 | v42.47,47.27 32.81,47.27 C37.1 | v46.04,35.86 52.65,35.86 v52.88,36.09 | v55.05,35.98 55.05,36.85 58.44,40.25 61.72,40.25 v61.89,40.07
XI  (via drill 0.6, 0.61)
  Top 0.254: 61.98,24.86 57.1,24.86 56.7,25.25 U2.30 56.7,35.64 60.5,39.44 C27.1 60.5,41.37 61.42,42.3 64.99,42.3 v65.11,42.41 | v71.37,45.4 71.37,47.96 Q1.1
  Top 0.406: R18.2 61.98,24.86
  Bottom 0.254: C27.1 58.03,40.84 v55.58,43.29 | v65.11,42.41 68.39,42.41 v71.37,45.4
XO  (via drill 0.6)
  Top 0.254: U2.29 56.2,23.88 57.15,22.93 64.73,22.93 R18.1 65.05,26.42 v65.05,27.5 | v67.74,41.65 67.69,41.7 Q1.2
  Bottom 0.254: v65.05,27.5 67.74,30.19 v67.74,41.65 | C26.1 65.14,50.89 Q1.2